# EasyEDA Pro project balance stm32.eprj

# Schematic Schematic1
Create Date: 2023-04-16; Page Name: P1; Project Name: balance stm32; Schematic Name: Schematic1; Update Date: 2023-04-17; Company: 嘉立创EDA; Page Size: A4; Version: V1.0
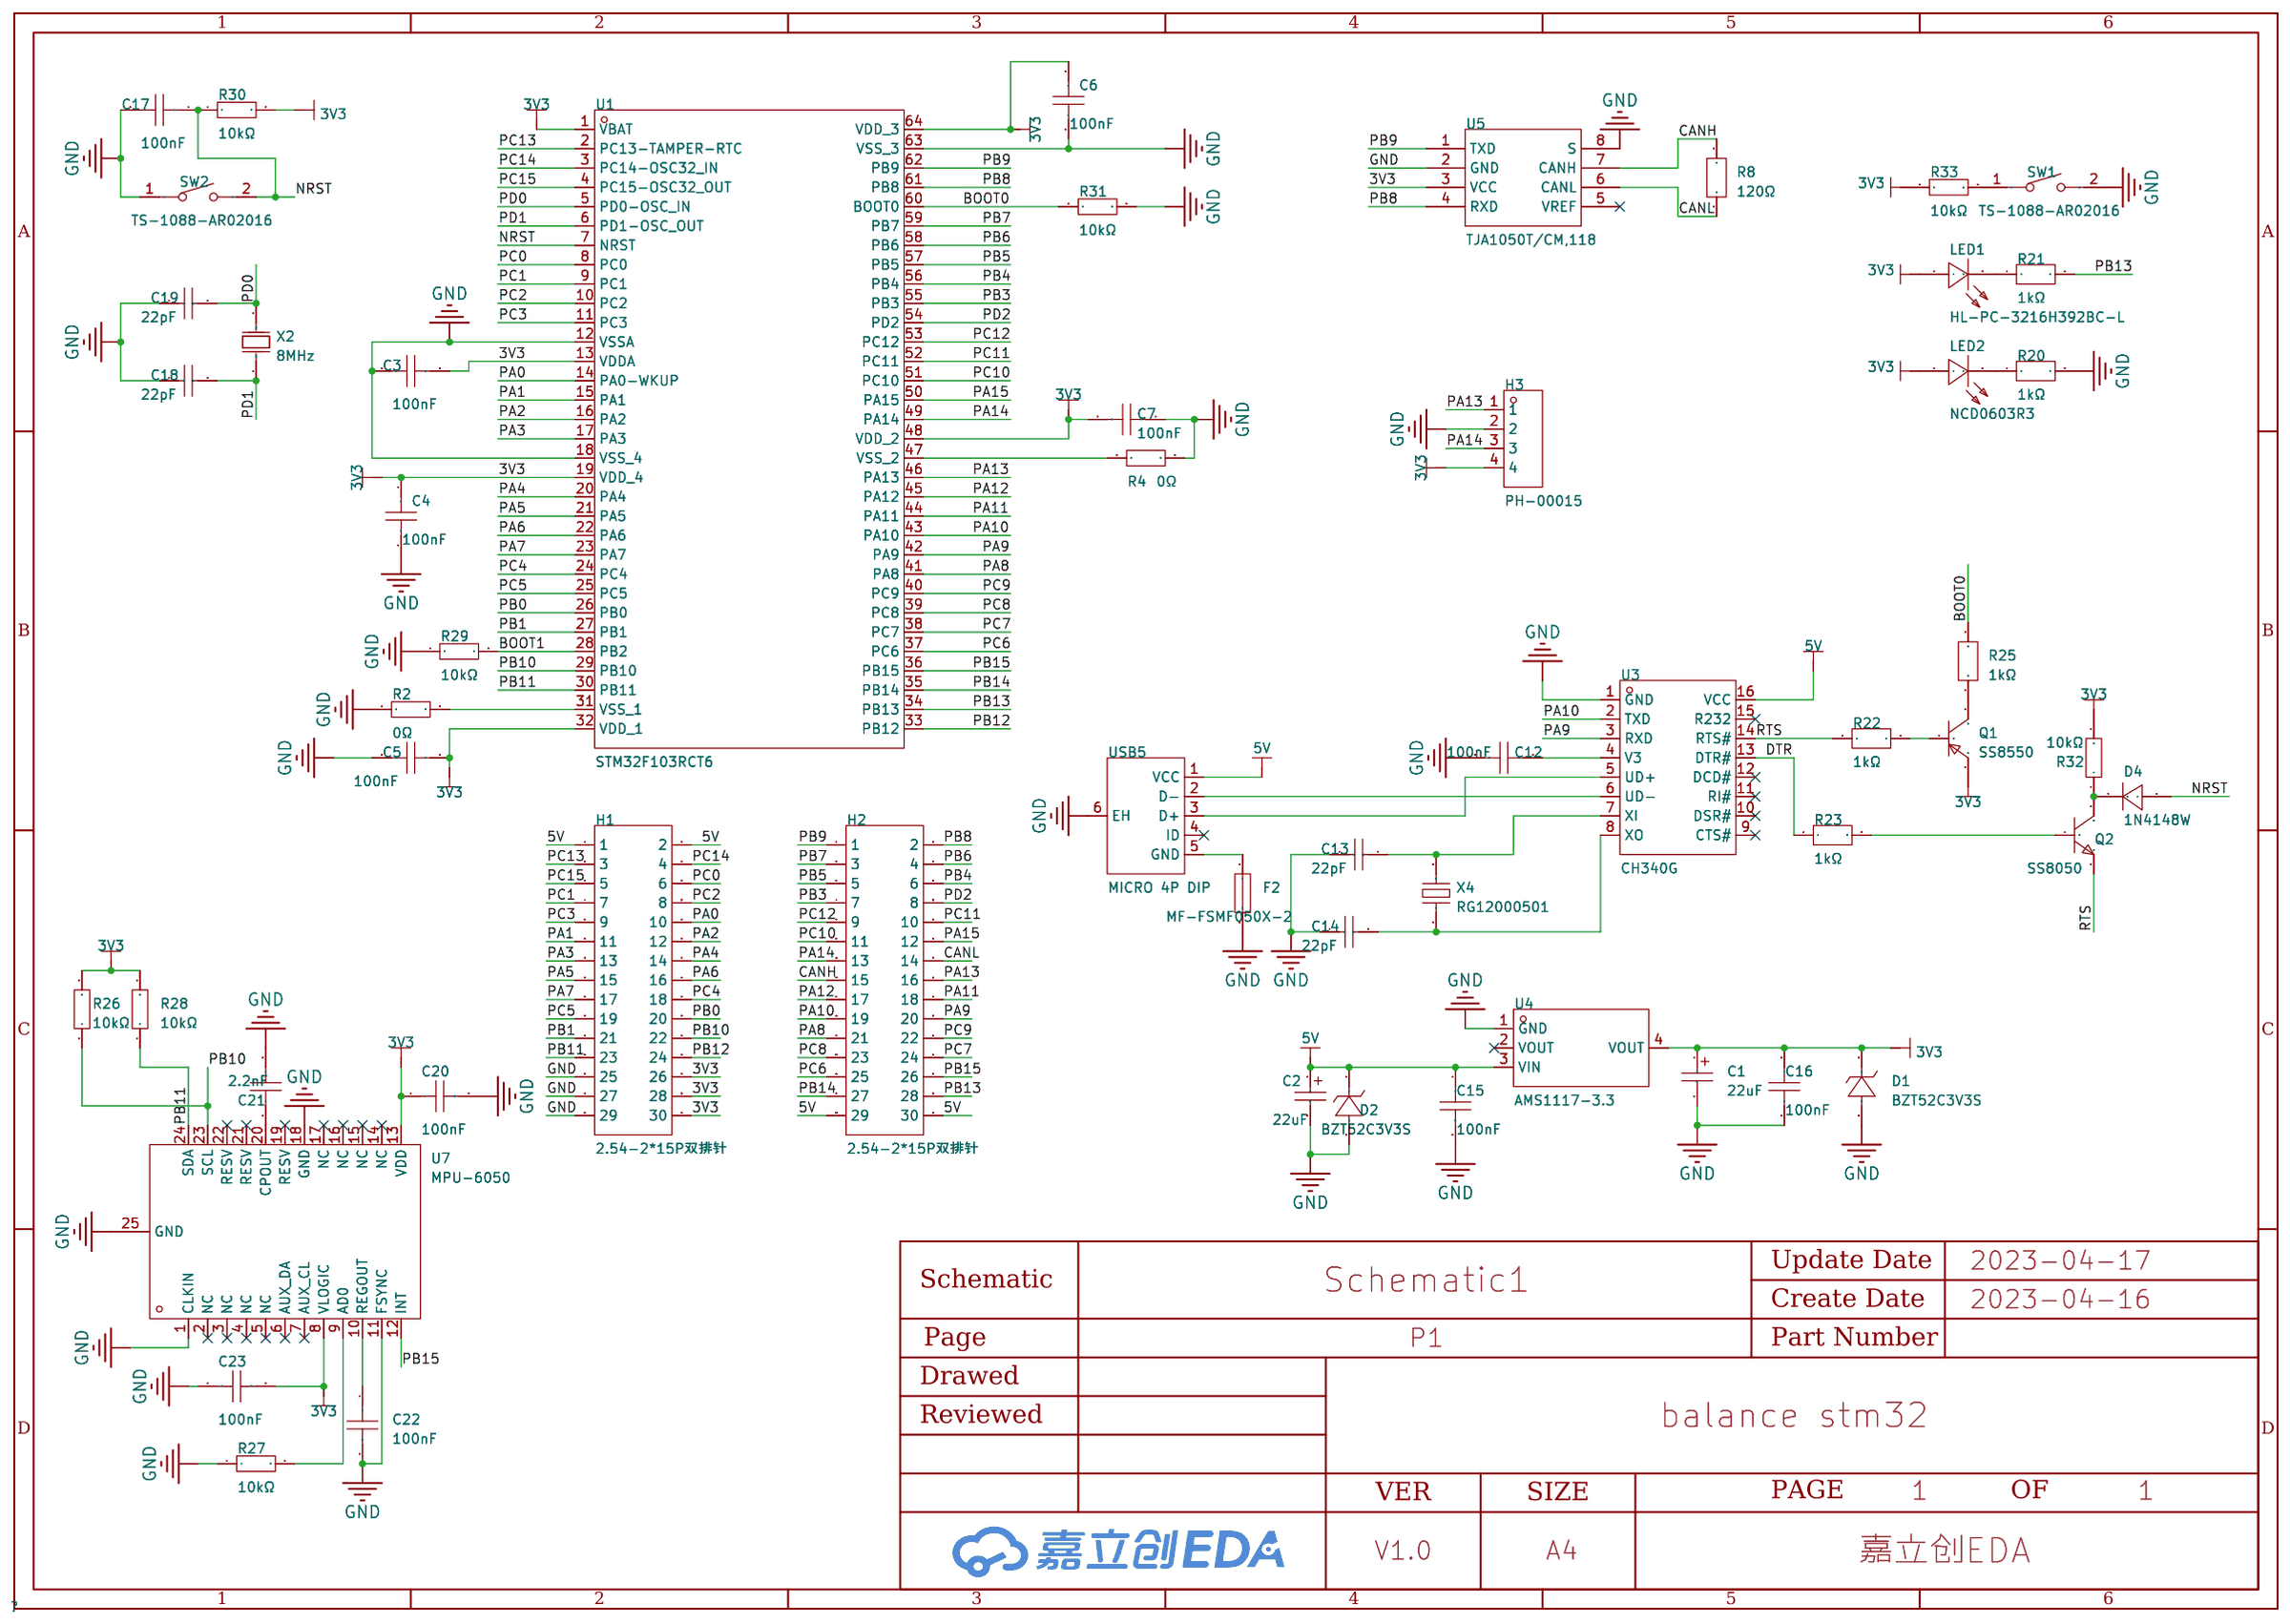
[diagram p0: schematic sheet]

## Parts
C1  22uF  [CAP-SMD_L7.3-W4.3-RD]
C2  22uF  [CAP-SMD_L7.3-W4.3-RD]
C3  100nF  [C0603]
C4  100nF  [C0603]
C5  100nF  [C0603]
C6  100nF  [C0603]
C7  100nF  [C0603]
C12  100nF  [C0603]
C13  22pF  [C0603]
C14  22pF  [C0603]
C15  100nF  [C0603]
C16  100nF  [C0603]
C17  100nF  [C0603]
C18  22pF  [C0603]
C19  22pF  [C0603]
C20  100nF  [C0603]
C21  2.2nF  [C0603]
C22  100nF  [C0603]
C23  100nF  [C0603]
D1  BZT52C3V3S  [SOD-323_L1.7-W1.3-LS2.6-RD-1]
D2  BZT52C3V3S  [SOD-323_L1.7-W1.3-LS2.6-RD-1]
D4  1N4148W  [SOD-123_L2.8-W1.8-LS3.7-RD]
F2  MF-FSMF050X-2  [F0603]
H1  2.54-2*15P双排针  [HDR-TH_30P-P2.54-V-M-R2-C15-S2.54]
H2  2.54-2*15P双排针  [HDR-TH_30P-P2.54-V-M-R2-C15-S2.54]
H3  PH-00015  [HDR-TH_4P-P2.54-V-M]
LED1  HL-PC-3216H392BC-L  [LED1206-R-RD_BLUE]
LED2  NCD0603R3  [LED0603-R-RD_RED]
Q1  SS8550  [SOT-23-3_L2.9-W1.3-P1.90-LS2.4-BR]
Q2  SS8050  [SOT-23-3_L2.9-W1.3-P1.90-LS2.4-BR]
R2  0Ω  [R0603]
R4  0Ω  [R0603]
R8  120Ω  [R0805]
R20  1kΩ  [R0603]
R21  1kΩ  [R0603]
R22  1kΩ  [R0603]
R23  1kΩ  [R0603]
R25  1kΩ  [R0603]
R26  10kΩ  [R0603]
R27  10kΩ  [R0603]
R28  10kΩ  [R0603]
R29  10kΩ  [R0603]
R30  10kΩ  [R0603]
R31  10kΩ  [R0603]
R32  10kΩ  [R0603]
R33  10kΩ  [R0603]
SW1  TS-1088-AR02016  [SW-SMD_L3.9-W3.0-P4.45]
SW2  TS-1088-AR02016  [SW-SMD_L3.9-W3.0-P4.45]
U1  STM32F103RCT6  [LQFP-64_L10.0-W10.0-P0.50-LS12.0-BL]
U3  CH340G  [SOIC-16_L9.9-W3.9-P1.27-LS6.0-BL]
U4  AMS1117-3.3  [SOT-223-3_L6.5-W3.4-P2.30-LS7.0-BR]
U5  TJA1050T/CM,118  [SOIC-8_L5.0-W4.0-P1.27-LS6.0-BL]
U7  MPU-6050  [QFN-24_L4.0-W4.0-P0.50-BL-EP2.7]
USB5  MICRO 4P DIP  [MINI-USB-SMD_MICRO-4P-DIP]
X2  8MHz  [CRYSTAL-SMD_L5.0-W3.2]
X4  RG12000501  [CRYSTAL-SMD_L5.0-W3.2]

## Library data of the parts
C1 C2 = TAJD226K035RNJ: 容值:22uF;精度:±10%;额定电压:35V;等效串联电阻:900mΩ@100kHz;; LCSC Part Name: 22uF ±10% 35V; Supplier Part: C7225; Manufacturer: Kyocera AVX; Supplier Footprint: CASE-D-7343; JLCPCB Part Class: Extended Part; Datasheet: https://atta.szlcsc.com/upload/public/pdf/source/20160107/1457707749466.pdf; Supplier: LCSC; Tolerance: ±10%; Rated Voltage: 35V; Equivalent Series Resistance(ESR): 900mΩ@100kHz; Operating Temperature: -55℃~+125℃
C3-C7 C12 C15-C17 C20 C22 C23 = CL10B104KB8NNNC: 容值:100nF;精度:±10%;额定电压:50V;材质(温度系数):X7R;; LCSC Part Name: 100nF ±10% 50V; Supplier Part: C1591; Manufacturer: SAMSUNG(三星); Supplier Footprint: 0603; JLCPCB Part Class: Extended Part; Datasheet: https://atta.szlcsc.com/upload/public/pdf/source/20160103/1457707680512.pdf; Supplier: LCSC; Tolerance: ±10%; Voltage Rated: 50V; Temperature Coefficient: X7R
C13 C14 C18 C19 = CL10C220JB8NNNC: 容值:22pF;精度:±5%;额定电压:50V;材质(温度系数):C0G;; LCSC Part Name: 22pF ±5% 50V; Supplier Part: C1653; Manufacturer: SAMSUNG(三星); Supplier Footprint: 0603; JLCPCB Part Class: Basic Part; Datasheet: https://atta.szlcsc.com/upload/public/pdf/source/20160103/1457707687317.pdf; Supplier: LCSC; Tolerance: ±5%; Voltage Rated: 50V; Temperature Coefficient: C0G
C21 = C1608C0G2E222JT000N: 容值:2.2nF;精度:±5%;额定电压:250V;材质(温度系数):C0G;; LCSC Part Name: 2.2nF ±5% 250V; Supplier Part: C694281; Manufacturer: TDK; Supplier Footprint: 0603; JLCPCB Part Class: Extended Part; Datasheet: https://atta.szlcsc.com/upload/public/pdf/source/20191129/C465875_2B14C4D62A20D308712483249251ED98.pdf; Supplier: LCSC; Tolerance: ±5%; Voltage Rated: 250V; Temperature Coefficient: C0G
D1 D2 = BZT52C3V3S_C2892655: 二极管配置:-;稳压值(标称值):3.3V;稳压值(范围):3.3V~3.5V;功率:200mW;反向电流(Ir):5uA@1V;阻抗(Zzt):95Ω;; LCSC Part Name: 3.3V 200mW; Supplier Part: C2892655; Manufacturer: YONGYUTAI(永裕泰); Supplier Footprint: SOD-323; JLCPCB Part Class: Extended Part; Datasheet: https://atta.szlcsc.com/upload/public/pdf/source/20210901/294368778B74EEB9B56A290250021D00.pdf; Supplier: LCSC; Zener Voltage (Nom): 3.3V; Zener Voltage (Range): 3.3V~3.5V; Power Dissipation: 200mW; Reverse Leakage Current (Ir): 5uA@1V; Zener Impedance (Zzt): 95Ω
D4 = 1N4148W_C444720: 二极管配置:-;功率:410mW;直流反向耐压(Vr):75V;平均整流电流(Io):150mA;正向压降(Vf):1V@10mA;反向电流(Ir):5uA@75V;反向恢复时间(trr):4ns;工作温度:-65℃~+150℃@(Tj);; LCSC Part Name: 75V 150mA 4ns; Supplier Part: C444720; Manufacturer: Slkor(萨科微); Supplier Footprint: SOD-123; JLCPCB Part Class: Extended Part; Datasheet: https://atta.szlcsc.com/upload/public/pdf/source/20191106/C444720_C99AED9C5DC79E991378A5E1255C8A91.pdf; Supplier: LCSC; Power Dissipation: 410mW; Reverse Voltage (Vr): 75V; Average Rectified Current (Io): 150mA; Forward Voltage (Vf@If): 1V@10mA; Reverse Leakage Current: 5uA@75V; Reverse Recovery Time (trr): 4ns; Operating Temperature: -65℃~+150℃@(Tj)
F2 = MF-FSMF050X-2: 最大电压:6V;最大电流:40A;保持电流:500mA;跳闸电流:1A;初始态阻值(最小值):800mΩ;跳断后阻值(最大值):100mΩ;最大动作时间:100ms;工作温度:-40℃~+85℃;; LCSC Part Name: 6V 500mA; Supplier Part: C210357; Manufacturer: BOURNS; Supplier Footprint: 0603; JLCPCB Part Class: Extended Part; Datasheet: https://atta.szlcsc.com/upload/public/pdf/source/20180524/C210357_26D2BEEFC098B5962B9D8AEB60E1F9FC.pdf; Supplier: LCSC; Operating Voltage (Max): 6V; Current Rating (Max): 40A; Hold Current: 500mA; Trip Current: 1A; Resistance - Initial (Ri) (Min): 800mΩ; Resistance - Post Trip (R1) (Max): 100mΩ; Maximum Time to Trip: 100ms; Operating Temperature: -40℃~+85℃
H1 H2 = 2.54-2*15P双排针: 排数:双排;总PIN位数:30;间距:2.54mm;插针结构:2x15P;行距:2.54mm;安装类型:直插;圆针/方针:方针;额定电流:3A;额定电压:-;配合针长度:6mm;塑高:-;端接针长度:3mm;触头材质:黄铜;触头镀层:-;工作温度范围:-40℃~+105℃;颜色:黑色;; LCSC Part Name: 2.54mm 2x15P 直插 方针; Supplier Part: C56496; Manufacturer: BOOMELE(博穆精密); Supplier Footprint: 插件,P=2.54mm; JLCPCB Part Class: Extended Part; Datasheet: https://atta.szlcsc.com/upload/public/pdf/source/20151109/1457707572823.pdf; Supplier: LCSC; Number of Rows: 双排; Number of Pins: 30; Pitch: 2.54mm; Pin Structure: 2x15P; Row Spacing: 2.54mm; Mounting Type: 直插; Circluar Pins/Square Pins: 方针; Current Rating (Max): 3A; Length of Mating Pin: 6mm; Length of End Connection Pin: 3mm; Contact Material: 黄铜; Operating Temperature Range: -40℃~+105℃; Color: 黑色
H3 = PH-00015: 排数:单排;总PIN位数:4;间距:2.54mm;插针结构:1x4P;行距:-;安装类型:直插;圆针/方针:方针;额定电流:3A;额定电压:-;配合针长度:6mm;塑高:2.5mm;端接针长度:3mm;触头材质:-;工作温度范围:-40℃~+105℃;颜色:黑色;; LCSC Part Name: 2.54mm 1x4P 直插 方针; Supplier Part: C2829888; Manufacturer: Liansheng(连盛); Supplier Footprint: 直插,P=2.54mm; JLCPCB Part Class: Extended Part; Datasheet: https://atta.szlcsc.com/upload/public/pdf/source/20210507/C2829888_39A693133DEF85B8C06C0B5A72669F0A.pdf; Supplier: LCSC; Number of Rows: 单排; Number of Pins: 4; Pitch: 2.54mm; Pin Structure: 1x4P; Mounting Type: 直插; Circluar Pins/Square Pins: 方针; Current Rating (Max): 3A; Length of Mating Pin: 6mm; Insulation Height: 2.5mm; Length of End Connection Pin: 3mm; Operating Temperature Range: -40℃~+105℃; Color: 黑色
LED1 = HL-PC-3216H392BC-L: 发光颜色:蓝灯;二极管配置:-;透镜颜色:无色透明;主波长:-;峰值波长:-;色温:-;光通量(25℃时):-;测试电流:-;正向电压(VF):-;发光强度:-;功率:70mW;发光角度:140°;安装方式:正贴;工作温度:-40℃~+85℃;; LCSC Part Name: 蓝灯 正贴; Supplier Part: C499462; Manufacturer: HONGLITRONIC(鸿利光电); Supplier Footprint: 1206; JLCPCB Part Class: Extended Part; Datasheet: https://atta.szlcsc.com/upload/public/pdf/source/20200909/C499462_BABAB62B39AB7DCF464B2BE1DB3A1906.pdf; Supplier: LCSC; Emitted Color: 蓝灯; Lens Color: 无色透明; Power Dissipation: 70mW; Viewing Angle: 140°; Mounting Sytle: 正贴; Operating Temperature: -40℃~+85℃
LED2 = NCD0603R3: 尺寸1.6x0.8x0.8；IF=20ma：1.6~2.6v，620~640nm,51~150mcd金线，光强高，功耗低，可靠性好，寿命长; LCSC Part Name: 红色;贴片LED;0603红灯;; Supplier Part: C3151730; Manufacturer: 国星光电; Supplier Footprint: 0603; JLCPCB Part Class: Extended Part; Datasheet: https://atta.szlcsc.com/upload/public/pdf/source/20220704/CBFF28C1847A97213A75929E60B7DDE7.pdf; Supplier: LCSC
Q1 = SS8550_C908251: 晶体管类型:PNP;集射极击穿电压(Vceo):25V;集电极电流(Ic):1.5A;功率(Pd):300mW;集电极截止电流(Icbo):100nA;集电极-发射极饱和电压(VCE(sat)@Ic,Ib):500mV@800mA,80mA;特征频率(fT):100MHz;工作温度:+150℃@(Tj);; LCSC Part Name: PNP 25V 1.5A; Supplier Part: C908251; Manufacturer: FUXINSEMI(富芯森美); Supplier Footprint: SOT-23; JLCPCB Part Class: Extended Part; Datasheet: https://atta.szlcsc.com/upload/public/pdf/source/20201027/C908251_48A0F0AFC9A08205A7B78B5388BD7DBD.pdf; Supplier: LCSC; Transistor Type: PNP; Collector-Emitter Breakdown Voltage (Vceo): 25V; Collector Current (Ic): 1.5A; Power Dissipation (Pd): 300mW; Collector Cut-Off Current (Icbo): 100nA; Collector-Emitter Saturation Voltage (VCE(sat)@Ic,Ib): 500mV@800mA,80mA; Transition Frequency (fT): 100MHz; Operating Temperature: +150℃@(Tj)
Q2 = SS8050_C908250: 晶体管类型:NPN;集射极击穿电压(Vceo):25V;集电极电流(Ic):1.5A;功率(Pd):300mW;集电极截止电流(Icbo):100nA;集电极-发射极饱和电压(VCE(sat)@Ic,Ib):500mV@800mA,80mA;特征频率(fT):100MHz;工作温度:+150℃@(Tj);; LCSC Part Name: NPN 25V 1.5A; Supplier Part: C908250; Manufacturer: FUXINSEMI(富芯森美); Supplier Footprint: SOT-23; JLCPCB Part Class: Extended Part; Datasheet: https://atta.szlcsc.com/upload/public/pdf/source/20201027/C908250_CBBAE5E534CE71250CC4CC45A9234FF7.pdf; Supplier: LCSC; Transistor Type: NPN; Collector-Emitter Breakdown Voltage (Vceo): 25V; Collector Current (Ic): 1.5A; Power Dissipation (Pd): 300mW; Collector Cut-Off Current (Icbo): 100nA; Collector-Emitter Saturation Voltage (VCE(sat)@Ic,Ib): 500mV@800mA,80mA; Transition Frequency (fT): 100MHz; Operating Temperature: +150℃@(Tj)
R2 R4 = PMR03EZPJ000: 电阻类型:厚膜电阻;阻值:0Ω;精度:-;功率:250mW;; LCSC Part Name: 0Ω 250mW; Supplier Part: C253507; Manufacturer: ROHM(罗姆); Supplier Footprint: 0603; JLCPCB Part Class: Extended Part; Datasheet: https://atta.szlcsc.com/upload/public/pdf/source/20180719/C253507_6F525903627FFADD099DFE748F70C63A.pdf; Supplier: LCSC; Type: 厚膜电阻; Power(Watts): 250mW; Operating Temperature Range: -55℃~+155℃
R8 = RTAN0805BKE120R: 电阻类型:薄膜电阻;阻值:120Ω;精度:±0.1%;功率:200mW;; LCSC Part Name: 120Ω ±0.1% 200mW; Supplier Part: C346745; Manufacturer: SEI(Stackpole Electronics Inc.); Supplier Footprint: 0805; JLCPCB Part Class: Extended Part; Datasheet: https://atta.szlcsc.com/upload/public/pdf/source/20190312/C346745_74DAE75996718173706B3DDD1902BC3F.pdf; Supplier: LCSC; Type: 薄膜电阻; Tolerance: ±0.1%; Power(Watts): 200mW; Temperature Coefficient: ±25ppm/℃; Overload Voltage (Max): 100V; Operating Temperature Range: -55℃~+155℃
R20-R23 R25 = ERA3VEB1001V: 电阻类型:薄膜电阻;阻值:1kΩ;精度:±0.1%;功率:100mW;; LCSC Part Name: 1kΩ ±0.1% 100mW; Supplier Part: C490794; Manufacturer: PANASONIC(松下); Supplier Footprint: 0603; JLCPCB Part Class: Extended Part; Datasheet: https://atta.szlcsc.com/upload/public/pdf/source/20200407/C490794_144E786BD6B5906C11E86C00580B1EF5.pdf; Supplier: LCSC; Type: 薄膜电阻; Tolerance: ±0.1%; Power(Watts): 100mW; Temperature Coefficient: ±25ppm/℃; Overload Voltage (Max): 100V; Operating Temperature Range: -55℃~+155℃
R26-R33 = ERJPB3B1002V: 电阻类型:厚膜电阻;阻值:10kΩ;精度:±0.1%;功率:200mW;; LCSC Part Name: 10kΩ ±0.1% 200mW; Supplier Part: C161787; Manufacturer: PANASONIC(松下); Supplier Footprint: 0603; JLCPCB Part Class: Extended Part; Datasheet: https://atta.szlcsc.com/upload/public/pdf/source/20180125/C161787_15168649453061302830.pdf; Supplier: LCSC; Type: 厚膜电阻; Tolerance: ±0.1%; Power(Watts): 200mW; Temperature Coefficient: ±50ppm/℃; Overload Voltage (Max): 200V; Operating Temperature Range: -55℃~+155℃
SW1 SW2 = TS-1088-AR02016: 触点电流:50mA;额定电压(DC):12V;绝缘电阻:100MΩ;电路结构:单刀单掷;安装方式:立贴;作用力:160gf@±50gf;机械寿命:10万次;带支架:否;; LCSC Part Name: 4*3*2mm 立贴 轻触开关; Supplier Part: C720477; Manufacturer: XUNPU(讯普); Supplier Footprint: SMD; JLCPCB Part Class: Extended Part; Datasheet: https://atta.szlcsc.com/upload/public/pdf/source/20200810/C720475_60D09DD6C54279ADDB2DC25100F1CC11.pdf; Supplier: LCSC; Contact Current: 50mA; Voltage Rating (DC): 12V; Insulation Resistance: 100MΩ; Circuit: 单刀单掷; Mounting Style: 立贴; Actuator Style: 圆形按钮; Actuator/Cap Color: 黑色; Operating Force: 160gf@±50gf; Mechanical Life: 10万次; Operating Temperature: -30℃~+80℃; Pin Style: SMD接片; Switch Length: 4mm; Switch Width: 3mm; Switch Height: 2mm; Strike Gundam: 否
U1 = STM32F103RCT6: CPU内核:ARM Cortex-M3;CPU最大主频:72MHz;工作电压范围:2V~3.6V;程序存储容量:256KB;RAM总容量:48KB;EEPROM/数据 FLASH容量:256KB;GPIO端口数量:51;ADC(位数):12bit;DAC(位数):12bit;(E)PWM(位数):-;外设/功能:DMA；看门狗；片载温度传感器；PWM;内部振荡器:有;工作温度范围:-40℃~+85℃;; LCSC Part Name: ARM Cortex-M3 72MHz; Supplier Part: C8323; Manufacturer: ST(意法半导体); Supplier Footprint: LQFP-64(10x10); JLCPCB Part Class: Extended Part; Datasheet: https://atta.szlcsc.com/upload/public/pdf/source/20161130/1480498797345.pdf; Supplier: LCSC; CPU Core: ARM Cortex-M3; CPU Maximum Speed: 72MHz; Operating Voltage Range: 2V~3.6V; Program Storage Size: 256KB; Program Memory Type: FLASH; RAM Size: 48KB; EEPROM: 256KB; GPIO Ports Number: 51; ADC (Bit): 12bit; DAC (Bit): 12bit; Peripheral/Function: DMA；看门狗；片载温度传感器；PWM; Internal Oscillator: 有; Operating Temperature Range: -40℃~+85℃
U3 = CH340G: 类型:Transceiver;协议类别:USB 2.0;驱动器/接收器数:-;数据速率:2Mbps;; Supplier Part: C14267; Manufacturer: WCH(南京沁恒); Supplier Footprint: SOP-16-150mil; JLCPCB Part Class: Extended Part; Datasheet: https://atta.szlcsc.com/upload/public/pdf/source/20200819/C14267_9F0B4B8160AEBA86F3219E64956E4601.pdf; Supplier: LCSC; Type: Transceiver; Protocol: USB 2.0; Data Rate: 2Mbps; Supply Voltage: 3.3V, 5V
U4 = AMS1117-3.3_C6186: 输出类型:固定;输出极性:正;最大输入电压:-;输出电压:3.3V;输出电流:1A;电源纹波抑制比(PSRR):72dB@(120Hz);; LCSC Part Name: 正 Vout=3.3V 1A 72dB@(120Hz); Supplier Part: C6186; Manufacturer: AMS; Supplier Footprint: SOT-223; JLCPCB Part Class: Basic Part; Datasheet: https://atta.szlcsc.com/upload/public/pdf/source/20180727/C6186_7A095716F0823C02F1997A905E26C086.pdf; Supplier: LCSC; Output Type: 固定; Output Polarity: 正; Number of Outputs: 1; Output Voltage: 3.3V; Dropout Voltage: 1.3V@(800mA); Output Current: 1A; Power Supply Rejection Ratio (PSRR): 72dB@(120Hz)
U5 = TJA1050T/CM,118: 类型:收发器;; Supplier Part: C6952; Manufacturer: NXP(恩智浦); Supplier Footprint: SOIC-8; JLCPCB Part Class: Basic Part; Datasheet: https://atta.szlcsc.com/upload/public/pdf/source/20140411/1457707042917.pdf; Supplier: LCSC; Type: 收发器; Supply Voltage: 4.75V~5.25V; Supply Current: 50mA
U7 = MPU-6050: 三轴加速度计和三轴陀螺仪，工作电压：2.375V~3.46V; Supplier Part: C24112; Manufacturer: TDK InvenSense(应美盛); Supplier Footprint: QFN-24(4x4); JLCPCB Part Class: Basic Part; Datasheet: https://atta.szlcsc.com/upload/public/pdf/source/20140425/1457707046159.pdf; Supplier: LCSC
USB5 = MICRO 4P DIP: 连接器类型:Micro-B;标准:USB 2.0;公母:母座;触点数量:4;端口数量:1;安装方式:卧贴;额定电流 - 电源:1A;工作温度范围:-30℃~+80℃;; LCSC Part Name: USB 母座/Micro 4脚插板直边平口,DIP+SMT母座; Supplier Part: C456008; Manufacturer: SHOU HAN(首韩); Supplier Footprint: SMD; JLCPCB Part Class: Extended Part; Datasheet: https://atta.szlcsc.com/upload/public/pdf/source/20191113/C456008_715AB785ACAEB21AD2CB341B96491593.pdf; Supplier: LCSC; Connector Type: Micro-B; Standard: USB 2.0; Gender: 母座; Number of Contacts: 4; Number of Ports: 1; Mounting Style: 卧贴; Current Rating - Power (Max): 1A; Operating Temperature Range: -30℃~+80℃
X2 = X50328MSB2GI: 频率:8MHz;频率公差:±10ppm;频率稳定度:±50ppm;负载电容:20pF;; LCSC Part Name: 8MHz ±10ppm 20pF YSX530GA; Supplier Part: C115962; Manufacturer: YXC(扬兴晶振); Supplier Footprint: SMD5032-2P; JLCPCB Part Class: Basic Part; Datasheet: https://atta.szlcsc.com/upload/public/pdf/source/20230220/0EBFFB9D6D8CE6A211407822BBB6C516.pdf; Supplier: LCSC; Crystal Type: 贴片无源晶振; Frequency Tolerance: ±10ppm; Frequency Stability: ±50ppm; Load Capacitance: 20pF; Operating Temperature: -40℃~+85℃
X4 = RG12000501: GLASS5032-2P; LCSC Part Name: 12M 20PF +-20PPM 80Ω; Supplier Part: C2929408; Manufacturer: TROQ(创捷); Supplier Footprint: SMD5032-2P; JLCPCB Part Class: Extended Part; Datasheet: https://atta.szlcsc.com/upload/public/pdf/source/20211222/D0ED47F2D28101903B869BE55665BC61.pdf; Supplier: LCSC

## Nets
3V3: C1.1 C3.2 C4.1 C5.1 C6.1 C7.2 C16.1 C20.1 C23.2 D1.1(K) H1.26 H1.28 H1.30 H3.4 LED1.1(A) LED2.1(A) Q1.2(E) R26.2 R28.2 R30.2 R32.2 R33.1 U1.1(VBAT) U1.13(VDDA) U1.19(VDD_4) U1.32(VDD_1) U1.48(VDD_2) U1.64(VDD_3) U4.4(VOUT) U5.3(VCC) U7.8(VLOGIC) U7.13(VDD)
5V: C2.1 C15.1 D2.1(K) H1.1 H1.2 H2.29 H2.30 U3.16(VCC) U4.3(VIN) USB5.1(VCC)
GND: C1.2 C2.2 C3.1 C4.2 C5.2 C6.2 C7.1 C12.2 C13.1 C14.1 C15.2 C16.2 C17.2 C18.1 C19.1 C20.2 C21.1 C22.2 C23.1 D1.2(A) D2.2(A) F2.1 H1.25 H1.27 H1.29 H3.2 R2.1 R4.2 R20.2 R27.1 R29.1 R31.2 SW1.2 SW2.1 U1.12(VSSA) U1.18(VSS_4) U1.63(VSS_3) U3.1(GND) U4.1(GND) U5.2(GND) U5.8(S) U7.1(CLKIN) U7.11(FSYNC) U7.18(GND) U7.25(GND) USB5.6(EH)
BOOT0: R25.2 R31.1 U1.60(BOOT0)
BOOT1: R29.2 U1.28(PB2)
CANH: H2.15 R8.2 U5.7(CANH)
CANL: H2.14 R8.1 U5.6(CANL)
DTR: R23.1 U3.13(DTR#)
NRST: C17.1 D4.2(A) R30.1 SW2.2 U1.7(NRST)
PA0: H1.10 U1.14(PA0-WKUP)
PA1: H1.11 U1.15(PA1)
PA2: H1.12 U1.16(PA2)
PA3: H1.13 U1.17(PA3)
PA4: H1.14 U1.20(PA4)
PA5: H1.15 U1.21(PA5)
PA6: H1.16 U1.22(PA6)
PA7: H1.17 U1.23(PA7)
PA8: H2.21 U1.41(PA8)
PA9: H2.20 U1.42(PA9) U3.3(RXD)
PA10: H2.19 U1.43(PA10) U3.2(TXD)
PA11: H2.18 U1.44(PA11)
PA12: H2.17 U1.45(PA12)
PA13: H2.16 H3.1 U1.46(PA13)
PA14: H2.13 H3.3 U1.49(PA14)
PA15: H2.12 U1.50(PA15)
PB0: H1.20 U1.26(PB0)
PB1: H1.21 U1.27(PB1)
PB3: H2.7 U1.55(PB3)
PB4: H2.6 U1.56(PB4)
PB5: H2.5 U1.57(PB5)
PB6: H2.4 U1.58(PB6)
PB7: H2.3 U1.59(PB7)
PB8: H2.2 U1.61(PB8) U5.4(RXD)
PB9: H2.1 U1.62(PB9) U5.1(TXD)
PB10: H1.22 R26.1 U1.29(PB10) U7.23(SCL)
PB11: H1.23 R28.1 U1.30(PB11) U7.24(SDA)
PB12: H1.24 U1.33(PB12)
PB13: H2.28 R21.2 U1.34(PB13)
PB14: H2.27 U1.35(PB14)
PB15: H2.26 U1.36(PB15) U7.12(INT)
PC0: H1.6 U1.8(PC0)
PC1: H1.7 U1.9(PC1)
PC2: H1.8 U1.10(PC2)
PC3: H1.9 U1.11(PC3)
PC4: H1.18 U1.24(PC4)
PC5: H1.19 U1.25(PC5)
PC6: H2.25 U1.37(PC6)
PC7: H2.24 U1.38(PC7)
PC8: H2.23 U1.39(PC8)
PC9: H2.22 U1.40(PC9)
PC10: H2.11 U1.51(PC10)
PC11: H2.10 U1.52(PC11)
PC12: H2.9 U1.53(PC12)
PC13: H1.3 U1.2(PC13-TAMPER-RTC)
PC14: H1.4 U1.3(PC14-OSC32_IN)
PC15: H1.5 U1.4(PC15-OSC32_OUT)
PD0: C19.2 U1.5(PD0-OSC_IN) X2.1(OSC1)
PD1: C18.2 U1.6(PD1-OSC_OUT) X2.2(OSC2)
PD2: H2.8 U1.54(PD2)
RTS: Q2.2(E) R22.1 U3.14(RTS#)
$1N3966: R2.2 U1.31(VSS_1)
$1N4507: R4.1 U1.47(VSS_2)
$1N5736: C12.1 U3.4(V3)
$1N5991: C13.2 U3.7(XI) X4.2
$1N5998: C14.2 U3.8(XO) X4.1
$1N6184: Q1.1(B) R22.2
$1N6269: Q2.1(B) R23.2
$1N6306: D4.1(C) Q2.3(C) R32.1
$1N13579: C21.2 U7.20(CPOUT)
$1N13826: C22.1 U7.10(REGOUT)
$1N13944: LED2.2(K) R20.1
$1N13983: LED1.2(K) R21.1
$1N14159: Q1.3(C) R25.1
$1N14251: R27.2 U7.9(AD0)
$1N16164: R33.2 SW1.1
$1N17997: F2.2 USB5.5(GND)
$1N18025: U3.6(UD-) USB5.2(D-)
$1N18029: U3.5(UD+) USB5.3(D+)

Not connected (* = marked no-connect by the designer): U3 9(CTS#)* 10(DSR#)* 11(RI#)* 12(DCD#)* 15(R232)*; U4 2(VOUT)*; U5 5(VREF)*; U7 2(NC)* 3(NC)* 4(NC)* 5(NC)* 6(AUX_DA)* 7(AUX_CL)* 14(NC)* 15(NC)* 16(NC)* 17(NC)* 19(RESV)* 21(RESV)* 22(RESV)*; USB5 4(ID)*

# Board PCB1
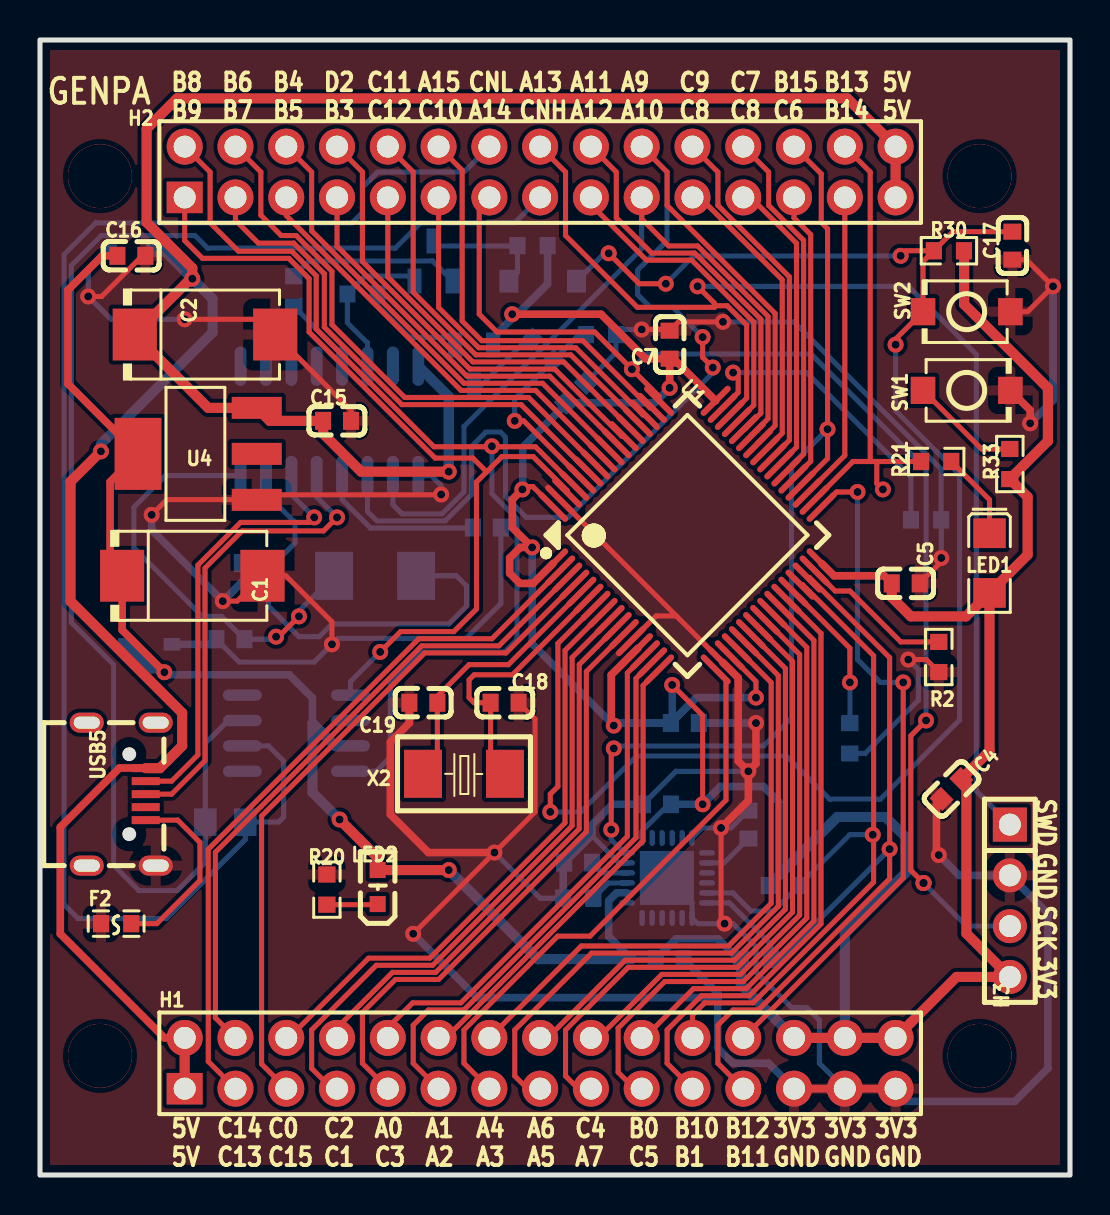
[diagram p1: board, top side]
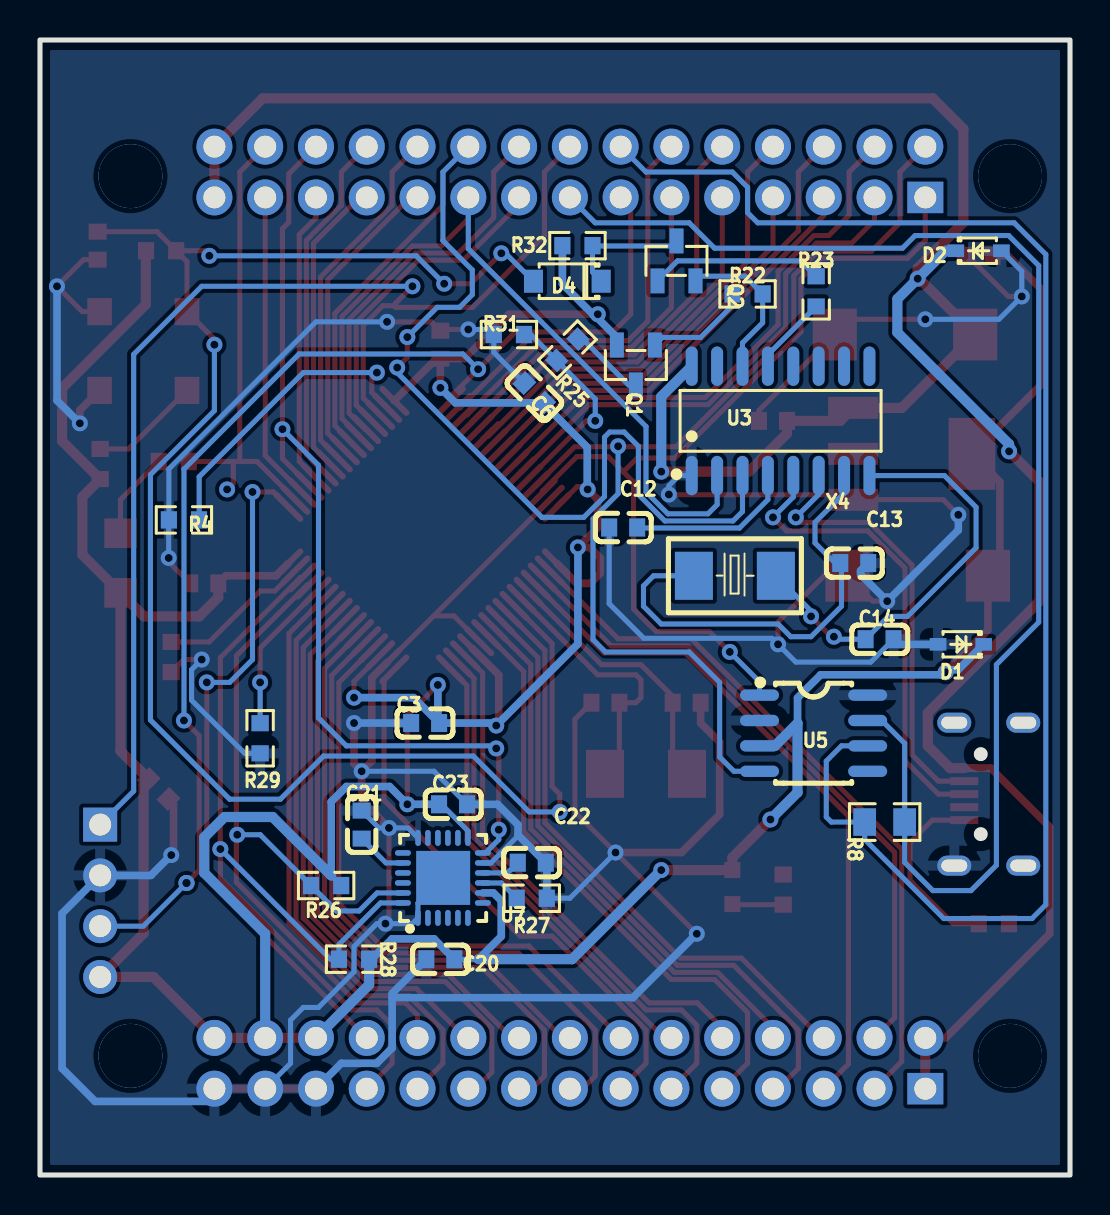
[diagram p2: board, bottom side, seen from below]

Outline 51.52 x 56.77 mm; copper layers: Top Layer, Bottom Layer. Coordinates in mm from the lower left corner of the outline.
Outline path: rectangle 0,56.77 51.52,0
Stack: Top Layer 0.035mm / Dielectric1 1.51mm FR4 er 4.5 / Bottom Layer 0.035mm

## Design rules (mm)
template: JLCPCB Capability(Two Layers Board)
spacing copperThickness1oz (default): track to track 0.102, other pairs 0.152 to 0.3
spacing copperThickness2oz: track to track 0.203, other pairs 0.152 to 0.3
track width copperThickness1oz (default): min 0.127, default 0.254, max 2.54
track width copperThickness2oz: min 0.203, default 0.254, max 2.54
differential pair differentialPair (default): width min 0.127, default 0.254, max 2.54; gap min 0.152, default 0.152
via viaSize (default): diameter min 0.5, default 0.61, max 10; hole min 0.3, default 0.305, max 6.3

## Placement (name value [footprint] x y rotation side)
C1  22uF  [CAP-SMD_L7.3-W4.3-RD]  7.62 29.97 180 top
C2  22uF  [CAP-SMD_L7.3-W4.3-RD]  8.25 42.04 180 top
C3  100nF  [C0603]  32.26 22.61 180 bottom
C4  100nF  [C0603]  45.59 19.3 225 top
C5  100nF  [C0603]  43.31 29.59 0 top
C6  100nF  [C0603]  26.8 39.12 45 bottom
C7  100nF  [C0603]  31.5 41.53 270 top
C12  100nF  [C0603]  22.35 32.38 0 bottom
C13  22pF  [C0603]  10.79 30.61 0 bottom
C14  22pF  [C0603]  9.53 26.8 0 bottom
C15  100nF  [C0603]  14.86 37.72 0 top
C16  100nF  [C0603]  4.57 45.97 0 top
C17  100nF  [C0603]  48.64 46.48 270 top
C18  22pF  [C0603]  23.24 23.62 180 top
C19  22pF  [C0603]  19.18 23.62 0 top
C20  100nF  [C0603]  31.5 10.79 0 bottom
C21  2.2nF  [C0603]  35.43 17.53 270 bottom
C22  100nF  [C0603]  26.92 15.62 180 bottom
C23  100nF  [C0603]  30.86 18.54 0 bottom
D1  BZT52C3V3S  [SOD-323_L1.7-W1.3-LS2.6-RD-1]  5.46 26.54 0 bottom
D2  BZT52C3V3S  [SOD-323_L1.7-W1.3-LS2.6-RD-1]  4.57 46.23 180 bottom
D4  1N4148W  [SOD-123_L2.8-W1.8-LS3.7-RD]  25.15 44.7 0 bottom
F2  MF-FSMF050X-2  [F0603]  3.81 12.57 0 top
H1  2.54-2*15P双排针  [HDR-TH_30P-P2.54-V-M-R2-C15-S2.54]  25.02 5.59 0 top
H2  2.54-2*15P双排针  [HDR-TH_30P-P2.54-V-M-R2-C15-S2.54]  25.02 50.16 0 top
H3  PH-00015  [HDR-TH_4P-P2.54-V-M]  48.51 13.72 270 top
LED1  HL-PC-3216H392BC-L  [LED1206-R-RD_BLUE]  47.5 30.61 270 top
LED2  NCD0603R3  [LED0603-R-RD_RED]  16.89 14.4 90 top
Q1  SS8550  [SOT-23-3_L2.9-W1.3-P1.90-LS2.4-BR]  21.72 40.51 90 bottom
Q2  SS8050  [SOT-23-3_L2.9-W1.3-P1.90-LS2.4-BR]  19.69 45.72 270 bottom
R2  0Ω  [R0603]  44.96 25.91 90 top
R4  0Ω  [R0603]  44.32 32.77 0 bottom
R8  120Ω  [r0805]  9.27 17.65 180 bottom
R20  1kΩ  [R0603]  14.35 14.27 90 top
R21  1kΩ  [R0603]  44.83 35.69 180 top
R22  1kΩ  [R0603]  16.13 44.07 0 bottom
R23  1kΩ  [R0603]  12.7 44.2 90 bottom
R25  1kΩ  [R0603]  25.15 41.27 315 bottom
R26  10kΩ  [R0603]  37.21 14.48 180 bottom
R27  10kΩ  [R0603]  26.92 13.84 0 bottom
R28  10kΩ  [R0603]  35.81 10.79 180 bottom
R29  10kΩ  [R0603]  40.51 21.84 90 bottom
R30  10kΩ  [R0603]  45.47 46.23 0 top
R31  10kΩ  [R0603]  28.07 42.04 0 bottom
R32  10kΩ  [R0603]  24.64 46.48 0 bottom
R33  10kΩ  [R0603]  48.51 35.56 90 top
SW1  TS-1088-AR02016  [SW-SMD_L3.9-W3.0-P4.45]  46.35 39.24 0 top
SW2  TS-1088-AR02016  [SW-SMD_L3.9-W3.0-P4.45]  46.35 43.18 180 top
U1  STM32F103RCT6  [LQFP-64_L10.0-W10.0-P0.50-LS12.0-BL]  32.38 32 315 top
U3  CH340G  [SOIC-16_L9.9-W3.9-P1.27-LS6.0-BL]  14.48 37.72 180 bottom
U4  AMS1117-3.3  [SOT-223-3_L6.5-W3.4-P2.30-LS7.0-BR]  7.87 36.07 0 top
U5  TJA1050T/CM,118  [SOIC-8_L5.0-W4.0-P1.27-LS6.0-BL]  12.83 22.1 270 bottom
U7  MPU-6050  [QFN-24_L4.0-W4.0-P0.50-BL-EP2.7]  31.37 14.86 180 bottom
USB5  MICRO 4P DIP  [MINI-USB-SMD_MICRO-4P-DIP]  4.06 19.05 270 top
X2  8MHz  [CRYSTAL-SMD_L5.0-W3.2]  21.21 20.07 0 top
X4  RG12000501  [CRYSTAL-SMD_L5.0-W3.2]  16.76 29.97 0 bottom

## Footprints (pads in the part's own frame, mm; a bottom-side part is the same pattern mirrored in y, then rotated)
C0603
  rect 0.8x0.9 smd: 1(-0.7,0) 2(0.7,0)
CAP-SMD_L7.3-W4.3-RD
  rect 2.208x2.592 smd: 1(3.511,0) 2(-3.511,0)
CRYSTAL-SMD_L5.0-W3.2
  rect 1.9x2.4 smd: 1(-2.05,0) 2(2.05,0)
F0603
  rect 0.806x0.864 smd: 1(-0.753,0) 2(0.753,0)
HDR-TH_4P-P2.54-V-M
  rect 1.7x1.7 hole 1.1: 1(-3.81,0)
  round 1.7 hole 1.1: 2(-1.27,0) 3(1.27,0) 4(3.81,0)
HDR-TH_30P-P2.54-V-M-R2-C15-S2.54
  rect 1.8x1.575 hole 1.1: 1(-17.78,-1.27)
  round 1.8 hole 1.1: 2(-17.78,1.27) 3(-15.24,-1.27) 4(-15.24,1.27) 5(-12.7,-1.27) 6(-12.7,1.27) 7(-10.16,-1.27) 8(-10.16,1.27) 9(-7.62,-1.27) 10(-7.62,1.27) 11(-5.08,-1.27) 12(-5.08,1.27) 13(-2.54,-1.27) 14(-2.54,1.27) 15(0,-1.27) 16(0,1.27) 17(2.54,-1.27) 18(2.54,1.27) 19(5.08,-1.27) 20(5.08,1.27) 21(7.62,-1.27) 22(7.62,1.27) 23(10.16,-1.27) 24(10.16,1.27) 25(12.7,-1.27) 26(12.7,1.27) 27(15.24,-1.27) 28(15.24,1.27) 29(17.78,-1.27) 30(17.78,1.27)
LED0603-R-RD_RED
  rect 0.8x0.8 smd: 1(0.851,0) 2(-0.851,0)
LED1206-R-RD_BLUE
  rect 1.485x1.62 smd: 1(1.492,0) 2(-1.492,0)
LQFP-64_L10.0-W10.0-P0.50-LS12.0-BL
  oval 0.3x2 smd: 1(-3.75,-5.75) 2(-3.25,-5.75) 3(-2.75,-5.75) 4(-2.25,-5.75) 5(-1.75,-5.75) 6(-1.25,-5.75) 7(-0.75,-5.75) 8(-0.25,-5.75) 9(0.25,-5.75) 10(0.75,-5.75) 11(1.25,-5.75) 12(1.75,-5.75) 13(2.25,-5.75) 14(2.75,-5.75) 15(3.25,-5.75) 16(3.75,-5.75) 33(3.75,5.75) 34(3.25,5.75) 35(2.75,5.75) 36(2.25,5.75) 37(1.75,5.75) 38(1.25,5.75) 39(0.75,5.75) 40(0.25,5.75) 41(-0.25,5.75) 42(-0.75,5.75) 43(-1.25,5.75) 44(-1.75,5.75) 45(-2.25,5.75) 46(-2.75,5.75) 47(-3.25,5.75) 48(-3.75,5.75)
  oval 2x0.3 smd: 17(5.75,-3.75) 18(5.75,-3.25) 19(5.75,-2.75) 20(5.75,-2.25) 21(5.75,-1.75) 22(5.75,-1.25) 23(5.75,-0.75) 24(5.75,-0.25) 25(5.75,0.25) 26(5.75,0.75) 27(5.75,1.25) 28(5.75,1.75) 29(5.75,2.25) 30(5.75,2.75) 31(5.75,3.25) 32(5.75,3.75) 49(-5.75,3.75) 50(-5.75,3.25) 51(-5.75,2.75) 52(-5.75,2.25) 53(-5.75,1.75) 54(-5.75,1.25) 55(-5.75,0.75) 56(-5.75,0.25) 57(-5.75,-0.25) 58(-5.75,-0.75) 59(-5.75,-1.25) 60(-5.75,-1.75) 61(-5.75,-2.25) 62(-5.75,-2.75) 63(-5.75,-3.25) 64(-5.75,-3.75)
MINI-USB-SMD_MICRO-4P-DIP
  rect 0.4x1.4 smd: 1(-1.3,1.225) 2(-0.65,1.225) 3(0,1.225) 4(0.65,1.225) 5(1.3,1.225)
  oval 1x1.7 hole 0.6x1.3: 6(-3.575,1.725) 6(-3.575,-1.725) 6(3.575,1.725) 6(3.575,-1.725)
QFN-24_L4.0-W4.0-P0.50-BL-EP2.7
  oval 0.28x0.8 smd: 1(-1.25,-2) 2(-0.75,-2) 3(-0.25,-2) 4(0.25,-2) 5(0.75,-2) 6(1.25,-2) 13(1.25,2) 14(0.75,2) 15(0.25,2) 16(-0.25,2) 17(-0.75,2) 18(-1.242,2)
  oval 0.8x0.28 smd: 7(2,-1.25) 8(2,-0.75) 9(2,-0.25) 10(2,0.25) 11(2,0.75) 12(2,1.25) 19(-2,1.25) 20(-2,0.75) 21(-2,0.25) 22(-2,-0.25) 23(-2,-0.75) 24(-2,-1.25)
  rect 2.7x2.7 smd: 25(0.013,0)
R0603
  rect 0.806x0.864 smd: 1(-0.753,0) 2(0.753,0)
r0805
  rect 1.133x1.377 smd: 1(-1,0) 2(1,0)
SOD-123_L2.8-W1.8-LS3.7-RD
  rect 0.95x1.15 smd: 1(-1.692,0) 2(1.692,0)
SOD-323_L1.7-W1.3-LS2.6-RD-1
  rect 0.83x0.63 smd: 1(-1.14,0) 2(1.14,0)
SOIC-8_L5.0-W4.0-P1.27-LS6.0-BL
  oval 0.569x1.95 smd: 1(-1.905,-2.705) 2(-0.635,-2.705) 3(0.635,-2.705) 4(1.905,-2.705) 5(1.905,2.705) 6(0.635,2.705) 7(-0.635,2.705) 8(-1.905,2.705)
SOIC-16_L9.9-W3.9-P1.27-LS6.0-BL
  oval 0.602x1.971 smd: 1(-4.445,-2.736) 2(-3.175,-2.736) 3(-1.905,-2.736) 4(-0.635,-2.736) 5(0.635,-2.736) 6(1.905,-2.736) 7(3.175,-2.736) 8(4.445,-2.736) 9(4.445,2.736) 10(3.175,2.736) 11(1.905,2.736) 12(0.635,2.736) 13(-0.635,2.736) 14(-1.905,2.736) 15(-3.175,2.736) 16(-4.445,2.736)
SOT-23-3_L2.9-W1.3-P1.90-LS2.4-BR
  rect 1.25x0.7 smd: 1(1,-0.95) 2(1,0.95) 3(-1,0)
SOT-223-3_L6.5-W3.4-P2.30-LS7.0-BR
  rect 2.5x1.1 smd: 1(2.97,-2.3) 2(2.97,0) 3(2.97,2.3)
  rect 2.34x3.6 smd: 4(-2.97,0)
SW-SMD_L3.9-W3.0-P4.45
  rect 1.23x1.36 smd: 1(-2.185,0) 2(2.185,0)

## Nets
As in the schematic.

Pads without a net: U3 9 10 11 12 15; U4 2; U5 5; U7 2 3 4 5 6 7 14 15 16 17 19 21 22; USB5 4

## Via types
v1: diameter 3.2, hole 3.2, Top Layer to Bottom Layer, 4 vias
v2: diameter 0.8, hole 0.4, Top Layer to Bottom Layer, 62 vias

## Routing (per net, layer and track width the routed paths; a pad name or vN(x,y) marks a point on that pad's centre or on a via; arc(x,y) is an arc through that point)
3V3: length 249.8
  Top Layer w0.254: v2(31.62,24.51) 33.15,22.99 v2(33.15,18.54) ; U1.64 24.65,34.43 24.27,34.43 v2(24.13,34.29) ; v2(35.81,23.88) 35.81,24.69 34.51,25.99
  Top Layer w0.381: v2(23.62,43.05) 28.07,43.05 30.29,40.83 31.37,40.83 ; v2(28.7,22.48) 28.57,22.61 28.57,25.01 29.91,26.35 ; C5.1 42.23,29.97 39.72,29.97 U1.32 ; v2(31.5,39.37) 31.5,40.7 31.37,40.83 ; v2(6.22,25.15) 4.11,27.26 C1.1 3.51,30.57 3.51,34.67 U4.4 1.4,39.57 1.4,44.26 3.11,45.97 C16.1 ; 31.37,40.83 31.69,40.83 U1.48 ; v2(24.13,34.29) 23.63,33.79 23.63,32.38 v2(24.62,31.39) 24.02,31.39 23.5,30.86 23.5,30.1 24,29.59 24.67,29.59 U1.1
  Top Layer w0.508: H1.26 H1.28 H1.30 45.85,9.91 H3.4 46.34,12.08 46.34,19.54 46.09,19.8 47.5,21.21 LED1.1 ; v2(14.99,17.78) 16.89,15.87 LED2.1 v2(20.45,15.25) ; C5.1 42.61,28.89 43.56,27.94 46.32,27.94 LED1.1 ; R30.2 46.23,46.22 46.23,43.55 50.42,39.36 50.42,36.71 R33.1 49.4,33.92 49.4,31.02 LED1.1
  Bottom Layer w0.254: 29.59,10.79 C20.1 ; R26.2 36.96,14.98 ; U7.13 30.12,17.22 31.44,18.54 C23.2 ; 31.38,22.61 31.56,22.61 ; v2(6.22,25.15) 6.22,25.27
  Bottom Layer w0.381: 31.56,22.61 32.83,23.88 v2(35.81,23.88) ; R32.2 25.39,44.57 23.88,43.05 v2(23.62,43.05) 23.62,42.85 22.67,41.89 Q1.2 ; U7.8 28.84,14.11 28.45,13.72 28.45,11.94 29.59,10.79 ; v2(31.5,39.37) 30.75,38.62 26.3,38.62 26.3,38.55 24.15,36.4 24.15,34.31 v2(24.13,34.29) ; D1.1 5.59,25.27 6.22,25.27 6.48,25.02 12.47,25.02 13.63,23.86 13.63,22.59 ; C23.2 v2(33.15,18.54) 34.04,19.43 36.19,19.43 36.96,18.67 36.96,14.98 ; R28.2 34.93,10.79 33.92,11.81 31.81,11.81 C20.1 ; v2(24.62,31.39) 24.62,26.56 v2(28.7,22.48) 28.83,22.61 31.38,22.61 31.62,22.85 v2(31.62,24.51)
  Bottom Layer w0.508: v2(20.45,15.25) 24.9,10.79 29.59,10.79 ; R28.2 35.06,9.52 H1.26 ; H1.28 40.26,12.06 43.31,15.11 43.31,16.89 42.29,17.91 39.89,17.91 36.96,14.98 ; v2(14.99,17.78) 13.63,19.14 13.63,22.59 14.76,21.46 15.53,21.46
5V: length 134.5
  Top Layer w0.381: H1.2 6.22,6.86 1.02,12.06 1.02,17.4 3.97,20.36 5.23,20.36 5.26,20.38 USB5.1
  Top Layer w0.508: v2(20.45,35.18) 16.06,35.18 14.16,37.08 C15.1 11.49,37.72 U4.3 8.41,38.37 C2.1 7.54,44.83 v2(7.62,44.83) 7.62,45.36 5.33,47.64 5.33,52.32 6.86,53.85 40.39,53.85 H2.30 H2.29 ; v2(3.05,36.19) 1.52,34.67 1.52,28.7 7.11,23.11 7.11,21.46 6,20.35 USB5.1 ; H1.1 H1.2
  Bottom Layer w0.508: D2.1 6.22,46.23 v2(7.62,44.83) 8.64,43.81 8.64,42.14 3.05,36.55 v2(3.05,36.19) ; v2(20.45,35.18) 20.45,38.93 U3.16
GND: length 286.3
  Top Layer w0.254: U1.12 30.82,27.96 31.83,27.96 ; v2(2.41,43.94) 3.08,43.94 5.12,45.97 C16.2 ; v2(45.09,30.86) 45.09,30.67 C5.2 ; C18.1 24.76,22.8 24.76,18.16 v2(22.73,16.13) v2(18.67,12.06) ; R2.1 44.33,25.78 v2(43.43,25.78) ; 31.83,27.96 U1.18 ; 31.83,27.96 U1.63 ; v2(7.24,42.8) 11,42.8 C2.2 15.56,38.24 C15.2 ; v2(5.59,33.02) 6.35,33.78 10.83,33.78 U4.1 11.1,34.02 20.05,34.02 v2(20.07,34.04) ; v2(34.24,12.57) 34.07,12.75 v2(34.07,17.36) ; v2(34.16,42.67) 31.94,42.67 31.5,42.23 ; C17.2 49.34,45.78 v2(50.67,44.45) 49.4,43.18 SW2.1 ; 31.37,42.23 31.31,42.29 v2(30.1,42.29) ; v2(9.14,28.7) 9.86,28.7 C1.2 12.3,29.97 14.6,27.66 v2(14.6,26.54)
  Top Layer w0.381: v2(44.96,16) 44.84,16.12 44.84,18.55 45.1,18.81 ; SW1.2 49.53,38.25 49.53,37.72 ; v2(35.43,20.19) 34.93,20.7 34.93,24.87 U1.18 ; v2(35.43,20.19) 35.43,18.73 v2(34.07,17.36) ; v2(35.43,20.19) 35.81,20.57 v2(35.81,22.61) ; C19.1 18.48,22.61 17.53,21.65 17.53,18.03 19.43,16.13 v2(22.73,16.13) ; H1.29 H1.27 H1.25
  Bottom Layer w0.254: U7.25 32.62,13.6 U7.1 32.91,12.57 v2(34.24,12.57) 34.67,12.57 35.81,11.43 35.81,10.16 37.59,8.38 38.35,8.38 38.99,7.75 38.99,5.59 H1.27 ; v2(20.07,34.04) 20.07,34.48 19.56,34.98 U3.1 ; C23.1 31.81,20.19 v2(35.43,20.19) ; C14.1 9.97,25.65 13.72,25.65 v2(14.6,26.54) 14.9,26.84 21.32,26.84 23.05,28.57 C12.2 ; v2(7.24,42.8) 3.56,42.8 v2(2.41,43.94) 2.41,45.21 3.43,46.23 ; v2(30.1,42.29) 29.07,42.29 R31.2 28.82,41.14 27.29,39.61 ; 27.61,16.97 28.97,15.61 U7.11 ; v2(34.16,42.67) 37.72,42.67 45.08,35.31 R4.2 45.09,32.76 v2(45.09,30.86) ; C21.1 34.57,17.36 v2(34.07,17.36) 33.11,17.36 U7.18 ; v2(22.73,16.13) 25.02,13.84 R27.1 ; R29.1 41.28,21.09 43.94,23.75 43.94,25.27 v2(43.43,25.78)
  Bottom Layer w0.381: v2(18.67,12.06) 21.87,8.87 33.91,8.87 ; v2(50.67,44.45) 50.67,38.74 v2(49.53,37.6) ; C20.2 33.91,9.08 33.91,8.87 ; H1.29 42.8,3.94 43.05,3.68 48.77,3.68 50.42,5.33 50.42,13.08 H3.2 45.97,14.99 v2(44.96,16) ; 33.91,8.87 33.91,6.35 34.67,5.59 36.45,5.59 H1.25 ; C13.1 10.48,30.23 10.48,30.03 v2(9.14,28.7) 5.59,32.26 v2(5.59,33.02) ; v2(35.81,22.61) C3.1 ; 30.03,18.54 28.64,18.54 27.61,17.52 27.61,17.01 C22.2 26.17,15.57 R27.1 ; D1.2 8.57,26.54 C14.1
(no net):
  vias: v1(3,49.96) v1(3,5.96) v1(47,49.96) v1(47,5.96)
BOOT0: length 10.5
  Top Layer w0.254: U1.60 24.19,37.72 v2(23.75,37.72)
  Bottom Layer w0.254: v2(23.75,37.72) 23.75,38.81 R25.2 26.97,42.04 R31.1
BOOT1: length 7.7
  Top Layer w0.254: v2(40.51,24.64) 40.51,26.35 U1.28
  Bottom Layer w0.254: v2(40.51,24.64) R29.2
CANH: length 70.2
  Bottom Layer w0.254: U5.7 9.41,22.73 8.27,21.59 R8.2 8.27,15.64 6.86,14.22 4.95,14.22 3.68,15.49 3.68,25.53 1.57,27.64 1.57,45.49 3.07,46.99 7.75,46.99 8.38,46.35 17.78,46.35 19.05,47.62 23.75,47.62 H2.15
CANL: length 75.8
  Bottom Layer w0.254: H2.14 21.21,50.16 16.89,50.16 16.13,49.4 16.13,48.13 15.62,47.62 2.79,47.62 1.21,46.04 1.21,13.52 1.91,12.83 6.31,12.83 10.27,16.79 R8.1 11.94,17.65 12.19,17.91 12.19,20.7 11.43,21.46 10.12,21.46
DTR: length 4
  Bottom Layer w0.254: U3.13 15.11,41.03 R23.1
NRST: length 85.1
  Top Layer w0.254: R30.1 43.31,46.23 v2(43.05,45.97) ; R30.1 44.17,45.69 SW2.2 42.8,41.81 v2(42.8,41.53) ; R30.1 45.67,47.18 C17.1 ; v2(25.53,18.16) 25.53,19.05 25.91,19.43 25.91,26.59 U1.7 ; v2(28.45,46.1) 29.97,44.58 v2(31.31,44.58)
  Bottom Layer w0.254: v2(43.05,45.97) 32.7,45.97 v2(31.31,44.58) ; v2(28.45,46.1) 28.24,46.1 D4.2 ; v2(42.8,41.53) 42.8,38.23 46,35.03 46,22.76 42.04,18.8 39.5,18.8 37.34,20.95 29.84,20.95 27.05,18.16 v2(25.53,18.16)
PA0: length 25.9
  Top Layer w0.254: H1.10 17.4,7.37 18.64,8.61 21.06,8.61 29.38,16.94 29.38,25.11 30.26,25.99
PA1: length 27.8
  Top Layer w0.254: U1.15 29.81,24.84 29.81,16.87 21.2,8.25 19.43,8.25 18.67,7.49 18.67,5.59 H1.11
PA2: length 23.2
  Top Layer w0.254: H1.12 20.31,6.86 30.17,16.72 30.17,24.48 U1.16
PA3: length 28.1
  Top Layer w0.254: U1.17 34.32,24.77 34.32,18.75 27.51,11.95 25.9,11.95 21.21,7.26 21.21,5.59 H1.13
PA4: length 30.4
  Top Layer w0.254: H1.14 27.08,11.46 34.44,11.46 36.58,13.59 36.58,24.63 34.86,26.35
PA5: length 33.6
  Top Layer w0.254: H1.15 24.38,4.32 23.75,4.95 23.75,7.26 27.59,11.1 34.59,11.1 36.93,13.44 36.93,24.98 U1.21
PA6: length 29.4
  Top Layer w0.254: U1.22 37.29,25.33 37.29,13.29 34.74,10.74 29.27,10.74 25.39,6.86 H1.16
PA7: length 32.6
  Top Layer w0.254: H1.17 26.92,4.32 26.29,4.95 26.29,7.26 29.42,10.39 34.89,10.39 37.64,13.15 37.64,25.68 U1.23
PA8: length 15.1
  Top Layer w0.254: H2.21 33.01,48.89 37.13,44.77 37.13,37.1 36.27,36.25
PA9: length 61.6
  Top Layer w0.254: U1.42 35.92,36.63 36.77,37.48 36.77,43.09 31.37,48.5 31.37,50.16 H2.20 ; v2(33.15,41.91) 33.15,40.89 v2(33.66,40.39)
  Bottom Layer w0.254: v2(33.66,40.39) 33.66,40.13 26.42,32.89 24.32,32.89 23.28,33.93 23.28,36.9 23.03,37.16 22.3,37.16 21.59,36.45 21.59,34.04 20.27,32.71 16.85,32.71 16.38,33.18 U3.3 ; H2.20 31.37,50.16 31.37,46.74 29.9,45.26 29.9,44.03 30.53,43.4 31.66,43.4 v2(33.15,41.91)
PA10: length 39.8
  Top Layer w0.254: U1.43 35.57,36.98 36.42,37.83 36.42,42.95 32.9,46.47 31.45,46.47 30.1,47.82 H2.19
  Bottom Layer w0.254: U3.2 17.65,33.53 18.11,33.07 20.12,33.07 21.21,34.16 21.21,37.44 30.1,46.33 H2.19
PA11: length 19.3
  Top Layer w0.254: U1.44 35.26,37.31 36.06,38.11 36.06,42.8 32.75,46.11 30.6,46.11 28.83,47.88 28.83,50.16 H2.18
PA12: length 16.3
  Top Layer w0.254: H2.17 27.56,48.54 30.34,45.76 32.6,45.76 35.71,42.65 35.71,38.51 34.86,37.66
PA13: length 61.8
  Top Layer w0.254: 34.51,38.01 35.35,38.86 35.35,42.5 34.38,43.48 33.81,43.48 33.73,43.4 ; 33.73,43.4 29.88,43.4 26.29,46.99 26.29,50.16 H2.16 ; 33.73,43.4 33.73,43.61 v2(32.89,44.45)
  Bottom Layer w0.254: v2(32.89,44.45) 43.43,44.45 46.84,41.05 46.84,19.2 H3.1
PA14: length 60.8
  Top Layer w0.254: v2(44.32,22.73) 43.56,21.97 43.56,15.24 v2(44.2,14.6) ; H2.13 21.97,48.39 21.97,43.05 22.86,42.16 27.75,42.16 v2(29.61,40.3) 30.97,38.94 U1.49
  Bottom Layer w0.254: 44.32,22.86 44.32,35.31 38.56,41.06 30.37,41.06 v2(29.61,40.3) ; H3.3 46.35,12.45 v2(44.2,14.6)
PA15: length 20.5
  Top Layer w0.254: H2.12 21.12,50.26 21.12,42.71 22.09,41.73 27.15,41.73 30.52,38.37 U1.50
PB0: length 27.5
  Top Layer w0.254: U1.26 38.71,26.74 38.71,12.7 35.33,9.32 32.69,9.32 30.23,6.86 H1.20
PB1: length 30.3
  Top Layer w0.254: U1.27 39.07,27.09 39.07,12.56 35.48,8.97 33.08,8.97 31.37,7.26 31.37,5.59 H1.21
PB3: length 20.5
  Top Layer w0.254: U1.55 25.5,39.95 21.36,39.95 14.86,46.45 H2.7
PB4: length 24.2
  Top Layer w0.254: 28.5,36.25 25.14,39.6 21.21,39.6 13.59,47.22 13.59,50.16 H2.6
PB5: length 21.7
  Top Layer w0.254: H2.5 12.32,47.99 21.06,39.24 24.79,39.24 28.14,35.89
PB6: length 27.4
  Top Layer w0.254: H2.4 11.05,50.16 11.05,48.01 12.06,46.99 12.81,46.99 14.6,45.2 14.6,42.53 18.25,38.89 24.44,38.89 U1.58
PB7: length 25.6
  Top Layer w0.254: H2.3 9.78,47.75 10.92,46.61 12.69,46.61 14.22,45.08 14.22,42.41 18.1,38.53 24.06,38.53 27.41,35.19 U1.59
PB8: length 52.9
  Top Layer w0.254: 26.73,34.48 24.78,36.42 19.71,36.42 13.82,42.31 13.82,44.98 12.59,46.2 9.93,46.2 8.51,47.62 8.51,50.16 H2.2
  Bottom Layer w0.254: v2(22.61,36.45) 22.61,34.08 23.86,32.82 23.86,26.78 23.24,26.16 19.05,26.16 17.53,24.64 17.53,20.91 16.81,20.19 15.66,20.19
PB9: length 44.4
  Top Layer w0.254: 22.34,35.17 23.1,35.93 24.67,35.93 26.37,34.23 26.37,34.12 ; 22.34,35.17 21.83,34.66 21.83,28.31 20.7,27.18 18.03,27.18 v2(17.02,26.16) ; 22.34,35.17 21.65,35.86 19.77,35.86 13.46,42.16 13.46,44.83 12.45,45.85 8.13,45.85 7.24,46.74 H2.1
  Bottom Layer w0.254: v2(17.02,26.16) 15.53,24.68 15.53,23.88
PB10: length 39.7
  Top Layer w0.254: 38.04,29.53 38.14,29.53 41.7,25.97 41.7,14.65 35.66,8.61 33.25,8.61 32.64,8 H1.22
  Bottom Layer w0.254: U7.23 34.66,14.11 35.56,13.21 36.69,13.21 R26.1 40.5,17.02 v2(41.66,17.02)
PB11: length 45.2
  Top Layer w0.254: 38.4,29.88 38.5,29.88 42.5,25.88 v2(42.5,16.3) 42.5,14.82 35.94,8.25 34.67,8.25 33.91,7.49 33.91,5.59 H1.23
  Bottom Layer w0.254: v2(42.5,16.3) 36.99,10.79 R28.1 36.57,11.53 34.49,13.61 U7.24
PB12: length 34.3
  Top Layer w0.254: H1.24 43.18,14.86 v2(43.18,24.64) ; U1.33 39.85,34.16 v2(40.89,34.16)
  Bottom Layer w0.254: v2(43.18,24.64) 42.04,24.64 40.89,25.78 v2(40.89,34.16)
PB13: length 23.9
  Top Layer w0.254: 41.53,35.69 41.53,35.69 41.53,50.16 H2.28 ; 41.53,35.69 40.66,35.69 U1.34 ; 41.53,35.69 41.86,35.69 ; 41.86,35.69 R21.2 ; 41.86,35.69 41.86,34.6 v2(42.16,34.29)
PB14: length 15.5
  Top Layer w0.254: H2.27 40.26,35.99 38.4,34.12
PB15: length 48.6
  Top Layer w0.254: v2(28.57,17.27) 28.57,21.21 v2(28.7,21.34) ; 38.04,34.48 39.4,35.83 v2(39.4,37.3) 39.4,47.33 39.08,47.65 39.08,50.07 H2.26
  Bottom Layer w0.254: v2(39.4,37.3) 37.59,35.5 37.59,22.86 36.19,21.46 28.83,21.46 v2(28.7,21.34) ; U7.12 29.24,16.11 28.57,16.78 v2(28.57,17.27)
PC0: length 29.7
  Top Layer w0.254: 28.14,28.11 26.26,26.24 26.26,17.61 19.5,10.85 16.43,10.85 12.45,6.86 H1.6
PC1: length 31.9
  Top Layer w0.254: H1.7 14.6,4.32 13.59,5.33 13.59,7.26 16.82,10.49 19.64,10.49 26.62,17.46 26.62,25.88 28.5,27.76
PC2: length 27.6
  Top Layer w0.254: U1.10 26.97,25.53 26.97,17.32 19.79,10.13 17.63,10.13 14.86,7.36 H1.8
PC3: length 29.9
  Top Layer w0.254: U1.11 27.33,25.18 27.33,17.17 19.94,9.78 17.78,9.78 16.13,8.13 16.13,5.59 H1.9
PC4: length 28.5
  Top Layer w0.254: H1.18 27.93,6.86 31.1,10.03 35.03,10.03 38,13 38,26.04 36.27,27.76
PC5: length 31.4
  Top Layer w0.254: 36.63,28.11 38.36,26.39 38.36,12.85 35.18,9.68 31.25,9.68 28.92,7.35 28.92,5.14 29.74,4.32 H1.19
PC6: length 14.8
  Top Layer w0.254: H2.25 37.72,47.87 38.55,47.03 38.55,35.7 U1.37
PC7: length 17.9
  Top Layer w0.254: U1.38 38.2,36.05 38.2,46.75 36.45,48.5 36.45,50.16 H2.24
PC8: length 15
  Top Layer w0.254: U1.39 37.84,36.4 37.84,46.6 35.55,48.89 H2.23
PC9: length 17.9
  Top Layer w0.254: H2.22 33.91,50.16 33.91,48.5 37.49,44.92 37.49,36.75 36.63,35.89
PC10: length 18.1
  Top Layer w0.254: H2.11 19.94,43.38 21.95,41.38 26.8,41.38 30.16,38.01 30.26,38.01
PC11: length 21.7
  Top Layer w0.254: 29.91,37.66 26.55,41.02 21.8,41.02 18.67,44.15 18.67,50.16 H2.10
PC12: length 19.3
  Top Layer w0.254: H2.9 17.4,44.92 21.65,40.67 26.2,40.67 U1.53
PC13: length 35.9
  Top Layer w0.254: H1.3 8.42,5.68 8.42,16.29 18.95,26.82 22.61,26.82 U1.2
PC14: length 33
  Top Layer w0.254: H1.4 8.77,7.86 8.77,16.14 19.1,26.47 22.96,26.47 26.37,29.88
PC15: length 34.6
  Top Layer w0.254: H1.5 11.09,5.55 11.09,17.95 19.24,26.11 23.31,26.11 26.73,29.53
PD0: length 13.5
  Top Layer w0.254: X2.1 19.88,20.78 C19.2 19.88,23.94 21.46,25.53 23.43,25.53 U1.5
PD1: length 13.6
  Top Layer w0.254: X2.2 22.54,20.78 C18.2 21.72,23.62 21.46,23.88 21.46,24.76 21.72,25.02 23.63,25.02 U1.6
PD2: length 23
  Top Layer w0.254: U1.54 29.1,36.95 25.75,40.31 21.51,40.31 16.13,45.69 16.13,50.16 H2.8
RTS: length 7.9
  Bottom Layer w0.254: Q2.2 18.5,44.96 16.26,44.96 R22.1 15.38,42.62 16.38,41.62 U3.14
$1N3966: length 7.7
  Top Layer w0.254: U1.31 39.78,29.21 40.51,29.21 43.06,26.66 R2.2
$1N4507: length 15.4
  Top Layer w0.254: U1.47 34.93,39.14 34.93,39.88 v2(34.67,40.13)
  Bottom Layer w0.254: v2(34.67,40.13) 38.35,40.13 43.56,34.92 43.56,32.77 R4.1
$1N5736: length 8.7
  Bottom Layer w0.254: U3.4 15.11,33.78 16.54,32.36 21.63,32.36 C12.1 21.91,32.13
$1N5991: length 22.8
  Bottom Layer w0.254: U3.7 11.3,34.09 12.75,32.64 12.75,31.61 11.75,30.61 C13.2 11.43,30.54 11.43,28.45 12.95,26.92 13.97,26.92 14.6,27.56 20.45,27.56 21.34,28.45 21.34,29.46 20.83,29.97 18.81,29.97
$1N5998: length 21.4
  Top Layer w0.254: v2(11.81,26.92) 11.94,26.92 v2(12.95,27.94)
  Bottom Layer w0.254: v2(12.95,27.94) 12.95,28.21 X4.1 ; v2(11.81,26.92) 11.68,26.8 C14.2 9.08,27.94 8.13,27.94 4.7,31.37 4.7,33.4 6.28,34.98 U3.8
$1N6184: length 5.3
  Bottom Layer w0.254: R22.2 16.88,43.49 18.48,41.89 20.39,41.89 Q1.1
$1N6269: length 8.7
  Bottom Layer w0.254: Q2.1 19.63,45.72 13.47,45.72 R23.2
$1N6306: length 6.6
  Bottom Layer w0.254: Q2.3 19.94,46.47 23.61,46.47 23.88,46.74 ; 23.31,44.58 23.88,45.16 R32.1
$1N13579: length 2.6
  Bottom Layer w0.254: C21.2 34.22,15.61 U7.20
$1N13826: length 2
  Bottom Layer w0.254: C22.1 28.14,15.11 U7.10
$1N13944: length 2.6
  Top Layer w0.254: LED2.2 16.86,13.52 R20.1
$1N13983: length 4.4
  Top Layer w0.254: R21.1 47.5,33.77 LED1.2
$1N14159: length 3.8
  Bottom Layer w0.254: R25.1 24.37,41.81 22.08,39.51 Q1.3
$1N14251: length 2
  Bottom Layer w0.254: U7.9 29.37,14.6 28.44,14.6 R27.2
$1N16164: length 5.6
  Top Layer w0.254: R33.2 47.1,36.31 SW1.1
$1N17997: length 9.4
  Top Layer w0.254: F2.2 5.84,12.57 8,14.73 8,16.64 6.89,17.75 USB5.5
$1N18025: length 22
  Top Layer w0.254: v2(13.72,32.89) 13.46,32.64 10.03,32.64 7.9,30.51 7.9,21.02 6.58,19.7 USB5.2
  Bottom Layer w0.254: U3.6 12.57,34.04 v2(13.72,32.89)
$1N18029: length 23.5
  Top Layer w0.254: v2(14.86,32.89) 14.18,32.21 10.11,32.21 8.25,30.36 8.25,20.72 6.58,19.05 USB5.3
  Bottom Layer w0.254: U3.5 13.84,33.91 v2(14.86,32.89)

## Copper pours and planes (outline as drawn; the poured copper is in the pictures)
GND on Top Layer: 0,56.77 51.52,56.77 51.52,0 0,0
GND on Bottom Layer: 0,56.77 51.52,56.77 51.52,0 0,0

## Text on the board
Top Silkscreen Layer: B8 / B9 | 5V / 5V | C14 / C13 | B6 / B7 | C0 / C15 | B4 / B5 | D2 / B3 | C2 / C1 | C11 / C12 | A0 / C3 | A15 / C10 | A1 / A2 | CNL / A14 | A4 / A3 | A13 / CNH | A6 / A5 | A11 / A12 | C4 / A7 | A9 / A10 | B0 / C5 | B10 / B1 | C9 / C8 | B12 / B11 | C7 / C8 | B15 / C6 | 3V3 / GND | B13 / B14 | SWD | GND | SCK | 3V3 | GENPA
